# Altium schematic sheet Buffer_Out.SchDoc
size A4
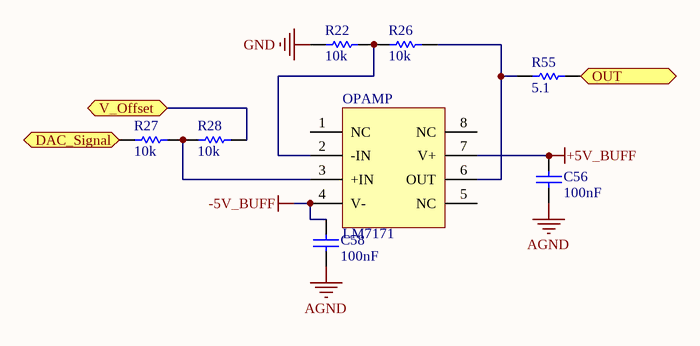
[diagram p0: Buffer_Out.SchDoc]

## Parts
C56  100nF  [CAP_0603]
C58  100nF  [CAP_0603]
OPAMP  LM7171  [SOIC8_N]
R22  10k  [RES_0603]
R26  10k  [RES_0603]
R27  10k  [RES_0603]
R28  10k  [RES_0603]
R55  5.1  [RES_0603]

## Ports
DAC_Signal (bidir), OUT (bidir), V_Offset (bidir)

## Nets
+5V_BUFF: C56.1 OPAMP.7(V+)
-5V_BUFF: C58.1 OPAMP.4(V-)
AGND: C56.2 C58.2
GND: R22.2
DAC_Signal: R27.2 ; port DAC_Signal
OUT: R55.1 ; port OUT
V_Offset: R28.1 ; port V_Offset
NetOPAMP_2: OPAMP.2(-IN) R22.1 R26.2
NetOPAMP_3: OPAMP.3(+IN) R27.1 R28.2
NetOPAMP_6: OPAMP.6(OUT) R26.1 R55.2

Not connected (* = marked no-connect by the designer): OPAMP 1(NC) 5(NC) 8(NC)

## Library data of the parts
C56 C58 = Cap_0603: Capacitor; Manufacturer Part-Number: LD03YC104KAB2A; Rule: PcbType=ProtelPcb; Published: 8-Jun-2000; LatestRevisionDate: 17-Jul-2002; LatestRevisionNote: Re-released for DXP Platform.; PackageReference: RAD-0.3; Publisher: Altium Limited; Value: 100nF; Digikey Part-Number: 478-4929-1-ND
OPAMP = OPAMP: IC OPAMP VFB 200MHZ 8SOIC; Manufacturer Part-Number: LM7171AIM/NOPB; Digikey Part-Number: LM7171AIM/NOPB-ND
R22 R26-R28 = Res0603: Manufacturer Part-Number: RC0603FR-0710KL; Published: 8-Jun-2000; LatestRevisionDate: 17-Jul-2002; LatestRevisionNote: Re-released for DXP Platform.; PackageReference: AXIAL-0.3; Publisher: Altium Limited; PackageDescription: Axial Device, Thru-Hole; 2 Leads; 0.3 in Pin Spacing; Digikey Part-Number: 311-10.0KHRCT-ND; Value: 10k
R55 = Res0603: Manufacturer Part-Number: ESR03EZPJ5R1; Published: 8-Jun-2000; LatestRevisionDate: 17-Jul-2002; LatestRevisionNote: Re-released for DXP Platform.; PackageReference: AXIAL-0.3; Publisher: Altium Limited; PackageDescription: Axial Device, Thru-Hole; 2 Leads; 0.3 in Pin Spacing; Digikey Part-Number: RHM5.1DCT-ND; Value: 5.1